# EAGLE schematic keycopy (EAGLE 6.3)
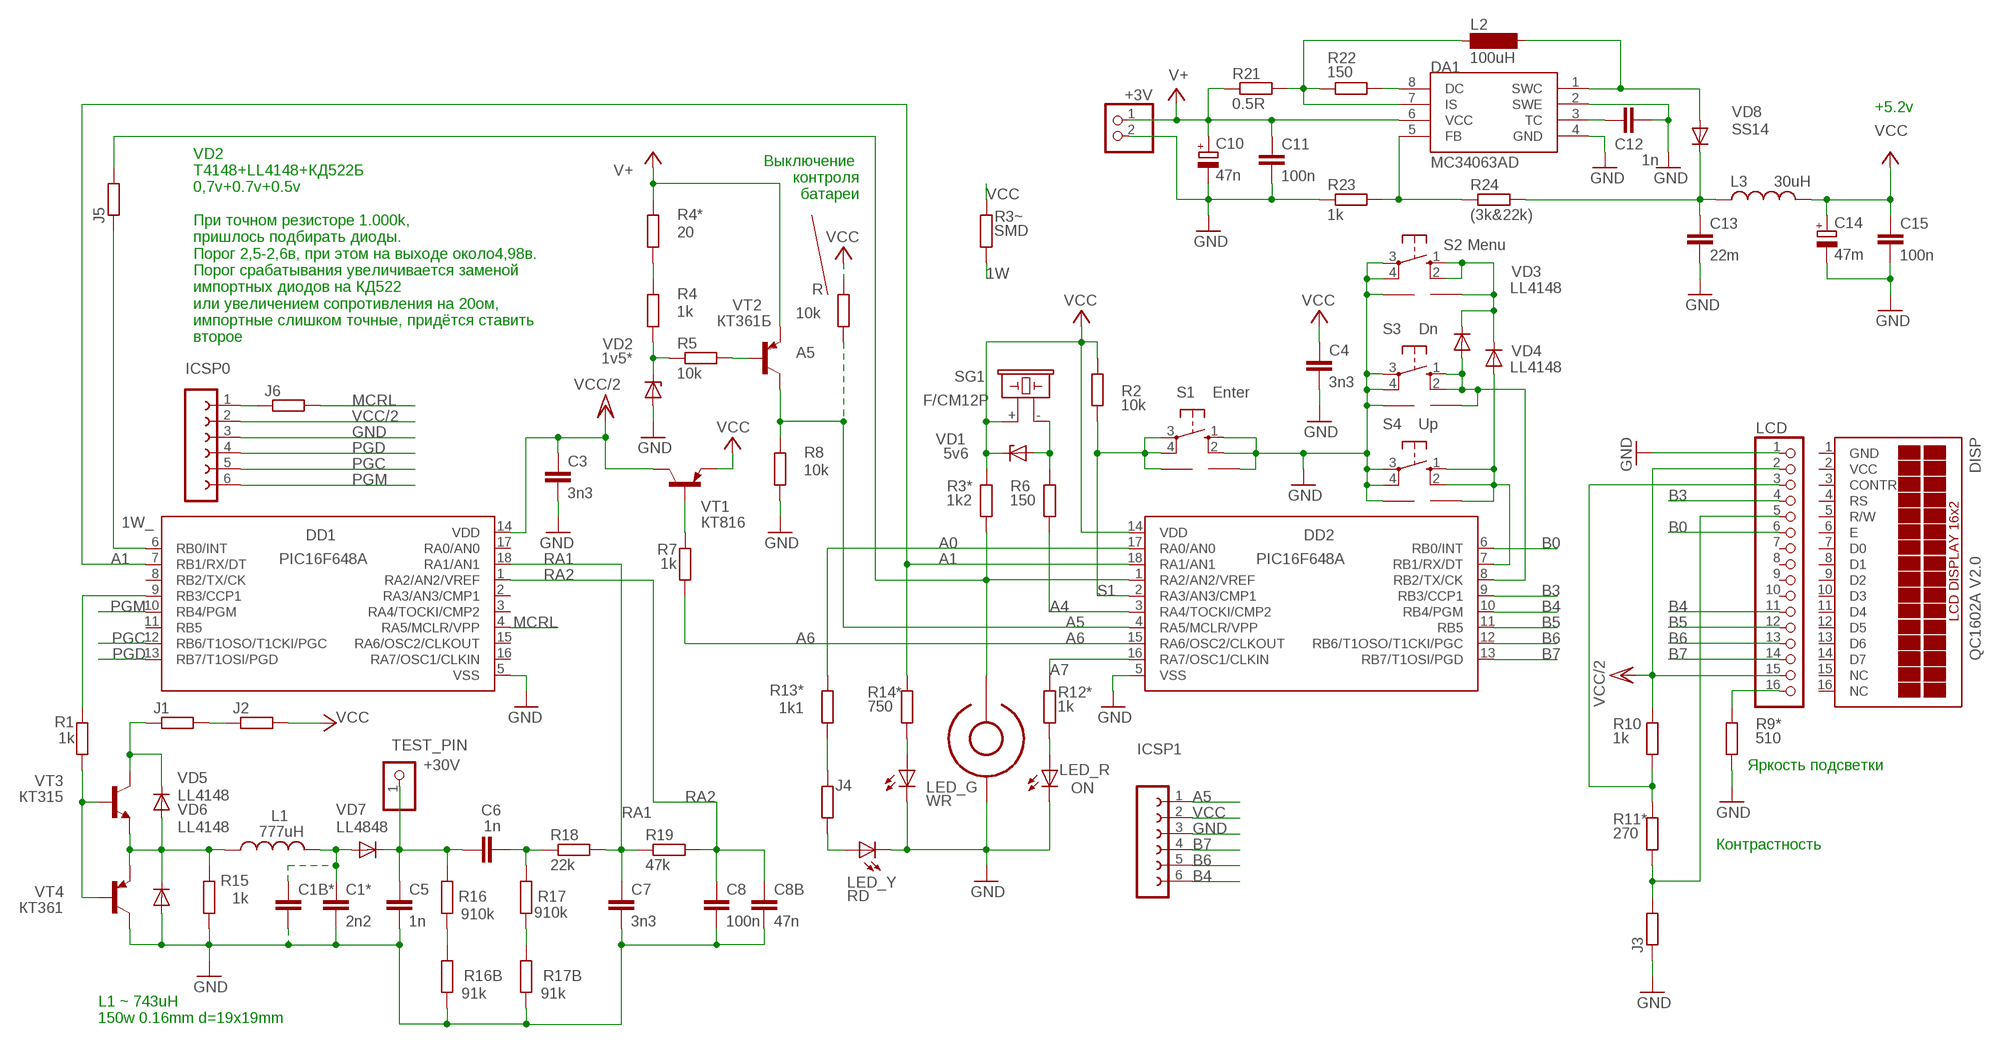
[diagram p0: schematic, sheet 1]

## Parts
+3V  PINHD-1X2  [1X02]
C1*  2n2  C-EU025-030X050  [C025-030X050]
C1B*  C-EU025-030X050  [C025-030X050]
C3  3n3  CAPPTH3  [CAP-PTH-LARGE]
C4  3n3  CAPPTH3  [CAP-PTH-LARGE]
C5  1n  C-EU025-030X050  [C025-030X050]
C6  1n  C-EU025-030X050  [C025-030X050]
C7  3n3  C-EU025-030X050  [C025-030X050]
C8  100n  C-EU025-030X050  [C025-030X050]
C8B  47n  C-EU025-030X050  [C025-030X050]
C10  47n  CPOL-EUE2.5-6  [E2,5-6]
C11  100n  C-EUC0805K  [C0805K]
C12  1n  C-EUC0805K  [C0805K]
C13  22m  C-EUC1210  [C1210]
C14  47m  CPOL-EUE2.5-6  [E2,5-6]
C15  100n  C-EUC0805K  [C0805K]
DA1  MC34063AD  [SOIC8]
DD1  PIC16F648A  PIC16F628SO  [SO-18W]
DD2  PIC16F648A  PIC16F628SO  [SO-18W]
DISP  QC1602A V2.0  TUXGR_16X2_R21  [TUXGR_16X2_1]
ICSP0  FE06-1  [FE06]
ICSP1  FE06-1  [FE06]
J1  R-EU_R1206W  [R1206W]
J2  R-EU_R1206W  [R1206W]
J3  R-EU_R1206W  [R1206W]
J4  R-EU_R1206W  [R1206W]
J5  R-EU_R1206W  [R1206W]
J6  R-EU_R0805W  [R0805W]
KEY  DS1990  [DS1990]
L1  777uH  L-US0207/2V  [0207/2V]
L2  100uH  SD12K100  [SD12K100]
L3  30uH  L-US0207/12  [0207/12]
LCD  PINHD-1X16  [1X16]
LED_G  WR  LED3MM  [LED3MM]
LED_R  ON  LED3MM  [LED3MM]
LED_Y  RD  LED3MM  [LED3MM]
R  10k  R-EU_R0805  [R0805]
R1  1k  R-EU_R1206W  [R1206W]
R2  10k  R-EU_R1206W  [R1206W]
R3*  1k2  R-EU_0204/7  [0204/7]
R3~  SMD  R-EU_M0805  [M0805]
R4  1k  R-EU_R1206W  [R1206W]
R4*  20  R-EU_R0805  [R0805]
R5  10k  R-EU_R0805  [R0805]
R6  150  R-EU_R0805  [R0805]
R7  1k  R-EU_R0805  [R0805]
R8  10k  R-EU_R1206W  [R1206W]
R9*  510  R-EU_R0805  [R0805]
R10  1k  R-EU_R0805  [R0805]
R11*  270  R-EU_0207/10  [0207/10]
R12*  1k  R-EU_R0805  [R0805]
R13*  1k1  R-EU_0207/10  [0207/10]
R14*  750  R-EU_0207/10  [0207/10]
R15  1k  R-EU_R0805  [R0805]
R16  910k  R-EU_R0805  [R0805]
R16B  91k  R-EU_R0805  [R0805]
R17  910k  R-EU_R0805  [R0805]
R17B  91k  R-EU_R0805  [R0805]
R18  22k  R-EU_R0805  [R0805]
R19  47k  R-EU_R0805  [R0805]
R21  0.5R  R-EU_R0805  [R0805]
R22  150  R-EU_R0805  [R0805]
R23  1k  R-EU_R0805  [R0805]
R24  (3k&22k)  R-EU_R1206W  [R1206W]
S1  Enter  10-XX  [B3F-10XX]
S2  Menu  10-XX  [B3F-10XX]
S3  Dn  10-XX  [B3F-10XX]
S4  Up  10-XX  [B3F-10XX]
SG1  F/CM12P  [F/CM12P]
TEST_PIN  +30V  PINHD-1X1  [1X01]
U$1  PROGRAMMER_5.08  [PROGRAMMER_KEY]
U$6  PROGRAMMER_5.08  [PROGRAMMER_KEY]
U$7  PROGRAMMER_5.08  [PROGRAMMER_KEY]
U$8  PROGRAMMER_5.08  [PROGRAMMER_KEY]
VD1  5v6  ZENER-DIODESOD80C  [SOD80C]
VD2  1v5*  ZENER-DIODEZD-5  [ZDIO-5]
VD3  LL4148  DIODE-SOD80C  [SOD80C]
VD4  LL4148  DIODE-SOD80C  [SOD80C]
VD5  LL4148  DIODE-SOD80C  [SOD80C]
VD6  LL4148  DIODE-SOD80C  [SOD80C]
VD7  LL4848  DIODE-SOD80C  [SOD80C]
VD8  SS14  DIODE-SMB  [SMB]
VT1  КТ816  BD140  [TO126]
VT2  КТ361Б  2SC1815-PNP-TO92-BCE  [TO92-BCE]
VT3  КТ315  -NPN-TO92-ECB  [TO92-ECB]
VT4  КТ361  2SC1815-PNP-TO92-BCE  [TO92-BCE]

## Nets
1W: DD2.1(RA2/AN2/VREF) J5.2 KEY.P$1 R3*.1 R3~.1
1W_: DD1.6(RB0/INT) J5.1
A0: DD2.17(RA0/AN0) R13*.2
A1: DD1.7(RB1/RX/DT) DD2.18(RA1/AN1) R14*.2
A4: DD2.3(RA4/TOCKI/CMP2) R6.1
A5: DD2.4(RA5/MCLR/VPP) ICSP1.1 R8.2 R.1 VT2.C
A6: DD2.15(RA6/OSC2/CLKOUT) R7.1
A7: DD2.16(RA7/OSC1/CLKIN) R12*.2
B0: DD2.6(RB0/INT) LCD.6
B3: DD2.9(RB3/CCP1) LCD.4
B4: DD2.10(RB4/PGM) ICSP1.6 LCD.11
B5: DD2.11(RB5) LCD.12
B6: DD2.12(RB6/T1OSO/T1CKI/PGC) ICSP1.5 LCD.13
B7: DD2.13(RB7/T1OSI/PGD) ICSP1.4 LCD.14
GND: +3V.2 C1*.2 C1B*.2 C3.2 C4.2 C5.2 C7.2 C8.2 C8B.2 C10.- C11.2 C12.2 C13.2 C14.- C15.2 DA1.2(SWE) DA1.4(GND) DD1.5(VSS) DD2.5(VSS) ICSP0.3 ICSP1.3 J3.1 KEY.P$2 LCD.1 LED_G.K(C) LED_R.K(C) LED_Y.K(C) R8.1 R9*.1 R15.1 R16B.1 R17B.1 R23.1 S1.1(S) S1.2(S1) S2.3(P) S2.4(P1) S3.3(P) S3.4(P1) S4.3(P) S4.4(P1) U$1.P$2 U$6.P$1 U$7.P$1 U$8.P$1 VD2.A VD6.A VT4.C
LG: LED_G.A R14*.1
LR: LED_R.A R12*.1
LY: J4.1 LED_Y.A
MCRL: DD1.4(RA5/MCLR/VPP) J6.2
N$1: R1.1 VT3.B VT4.B
N$2: C1*.1 C1B*.1 L1.2 VD7.A
N$3: C13.1 L3.1 R24.2 VD8.C
N$4: DD1.9(RB3/CCP1) R1.2
N$6: C5.1 C6.1 R16.2 TEST_PIN.1 VD7.C
N$7: R7.2 VT1.3(B)
N$8: R6.2 SG1.- VD1.A
N$9: LCD.16 R9*.2
N$10: J1.1 VD5.C VT3.C
N$11: R16.1 R16B.2
N$12: LCD.3 R10.1 R11*.2
N$13: DD2.7(RB1/RX/DT) S4.1(S) S4.2(S1) U$6.P$2 VD4.A
N$14: S2.1(S) S2.2(S1) U$8.P$2 VD3.C VD4.C
N$15: DD2.8(RB2/TX/CK) S3.1(S) S3.2(S1) U$7.P$2 VD3.A
N$16: C6.2 R17.2 R18.1
N$17: R4.1 R5.1 VD2.C
N$18: R5.2 VT2.B
N$19: ICSP0.1 J6.1
N$20: J4.2 R13*.1
N$21: L1.1 R15.2 VD5.A VD6.C VT3.E VT4.E
N$22: J1.2 J2.1
N$23: R17.1 R17B.2
N$24: J3.2 LCD.5 R11*.1
N$26: C12.1 DA1.3(TC)
N$28: DA1.1(SWC) L2.2 VD8.A
N$29: DA1.7(IS) L2.1 R21.2 R22.1
N$30: DA1.8(DC) R22.2
N$31: DA1.5(FB) R23.2 R24.1
N$38: R4*.1 R4.2
PGC: DD1.12(RB6/T1OSO/T1CKI/PGC) ICSP0.5
PGD: DD1.13(RB7/T1OSI/PGD) ICSP0.4
PGM: DD1.10(RB4/PGM) ICSP0.6
RA1: C7.1 DD1.18(RA1/AN1) R18.2 R19.1
RA2: C8.1 C8B.1 DD1.1(RA2/AN2/VREF) R19.2
S1: DD2.2(RA3/AN3/CMP1) R2.1 S1.3(P) S1.4(P1) U$1.P$1
V+: +3V.1 C10.+ C11.1 DA1.6(VCC) R4*.2 R21.1 VT2.E
VCC: C4.1 C14.+ C15.1 DD2.14(VDD) ICSP1.2 J2.2 L3.2 R2.2 R3*.2 R3~.2 R.2 SG1.+ VD1.C VT1.1(E)
VCC/2: C3.1 DD1.14(VDD) ICSP0.2 LCD.2 LCD.15 R10.2 VT1.2(C)
Unconnected: DD1.2(RA3/AN3/CMP1) DD1.3(RA4/TOCKI/CMP2) DD1.8(RB2/TX/CK) DD1.11(RB5) DD1.15(RA6/OSC2/CLKOUT) DD1.16(RA7/OSC1/CLKIN) DD1.17(RA0/AN0) DISP.3(CONTR) DISP.4(RS) DISP.5(R/W) DISP.6(E) DISP.7(D0) DISP.8(D1) DISP.9(D2) DISP.10(D3) DISP.11(D4) DISP.12(D5) DISP.13(D6) DISP.14(D7) DISP.15(NC) DISP.16(NC) LCD.7 LCD.8 LCD.9 LCD.10

## Notes on the sheet
- +5.2v
- Выключение 
  контроля
  батареи
- VD2
  T4148+LL4148+КД522Б 
  0,7v+0.7v+0.5v
  
  При точном резисторе 1.000k, 
  пришлось подбирать диоды.
  Порог 2,5-2,6в, при этом на выходе около4,98в.
  Порог срабатывания увеличивается заменой
  импортных диодов на КД522 
  или увеличением сопротивления на 20ом, 
  импортные слишком точные, придётся ставить
  второе
- Яркость подсветки
- Контрастность
- L1 ~ 743uH
  150w 0.16mm d=19x19mm

## Power pins joined to a net without a drawn wire
GND: DISP.1(GND)
VCC: DISP.2(VCC)

## Library data of the parts
+3V = keycopy:PINHD-1X2: PIN HEADER
C1* C1B* C5-C8 C8B = keycopy:C-EU: CAPACITOR, European symbol
C3 C4 = keycopy:CAP: Capacitor Standard 0603 ceramic capacitor, and 0.1" leaded capacitor.
C10 C14 = keycopy:CPOL-EU: POLARIZED CAPACITOR, European symbol
C11 C12 C15 = resistor:C-EU: CAPACITOR, European symbol
C13 = rcl:C-EU: CAPACITOR, European symbol
DA1 = mc34063:MC34063
DD1 DD2 = microchip:PIC16F62*: FLASH-Based 8-Bit CMOS Microcontroller Source: http://ww1.microchip.com/downloads/en/DeviceDoc/40300C.pdf; MF: MICROCHIP; MPN: PIC16F628-20I/SO; OC_FARNELL: 9760415; OC_NEWARK: 23C4986
DISP = keycopy:TUXGR_16X2_R2: Tuxgraphics LCD display 16x2 characters reflective, without background light Source: tuxgr_12x2_r2.pdf
ICSP0 ICSP1 = con-lsta:FE06-1: FEMALE HEADER; OC_FARNELL: unknown; OC_NEWARK: unknown
J1-J6 R1 R3* R3~ R7 R9* R11* R13* R14* = keycopy:R-EU_: RESISTOR, European symbol
KEY = keysens:DS1990
L1 = keycopy:L-US: INDUCTOR, American symbol
L2 = inductor-neosid:SD12: INDUCTOR nominal inductance; OC_FARNELL: unknown; OC_NEWARK: unknown
L3 = rcl:L-US: INDUCTOR, American symbol
LCD = pinhead:PINHD-1X16: PIN HEADER
LED_G LED_Y = keycopy2:LED: LED OSRAM: - CHIPLED LG R971, LG N971, LY N971, LG Q971, LY Q971, LO R971, LY R971 LH N974, LH R974 LS Q976, LO Q976, LY Q976 LO Q996 - Hyper CHIPLED LW Q18S LB Q993, LB Q99A, LB R99A - SideLED LS A670, LO A670, LY A670, LG A670, LP A670 LB A673, LV A673, LT A673, LW A673 LH A674 LY A675 LS A676, LA A676, LO A676, LY A676, LW A676 LS A679, LY A679, LG A679 - Hyper Micro SIDELED® LS Y876, LA Y876, LO Y876, LY Y876 LT Y87S - SmartLED LW L88C, LW L88S LB L89C, LB L89S, LG L890 LS L89K, LO L89K, LY L89K LS L896, LA L896, LO L896, LY L896 - TOPLED LS T670, LO T670, LY T670, LG T670, LP T670 LSG T670, LSP T670, LSY T670, LOP T670, LYG T670 LG T671, LOG T671, LSG T671 LB T673, LV T673, LT T673, LW T673 LH T674 LS T676, LA T676, LO T676, LY T676, LB T676, LH T676, LSB T676, LW T676 LB T67C, LV T67C, LT T67C, LS T67K, LO T67K, LY T67K, LW E67C LS E67B, LA E67B, LO E67B, LY E67B, LB E67C, LV E67C, LT E67C LW T67C LS T679, LY T679, LG T679 LS T770, LO T770, LY T770, LG T770, LP T770 LB T773, LV T773, LT T773, LW T773 LH T774 LS E675, LA E675, LY E675, LS T675 LS T776, LA T776, LO T776, LY T776, LB T776 LHGB T686 LT T68C, LB T68C - Hyper Mini TOPLED® LB M676 - Mini TOPLED Santana® LG M470 LS M47K, LO M47K, LY M47K Source: http://www.osram.convergy.de LUXEON: - LUMILED® LXK2-PW12-R00, LXK2-PW12-S00, LXK2-PW14-U00, LXK2-PW14-V00 LXK2-PM12-R00, LXK2-PM12-S00, LXK2-PM14-U00 LXK2-PE12-Q00, LXK2-PE12-R00, LXK2-PE12-S00, LXK2-PE14-T00, LXK2-PE14-U00 LXK2-PB12-K00, LXK2-PB12-L00, LXK2-PB12-M00, LXK2-PB14-N00, LXK2-PB14-P00, LXK2-PB14-Q00 LXK2-PR12-L00, LXK2-PR12-M00, LXK2-PR14-Q00, LXK2-PR14-R00 LXK2-PD12-Q00, LXK2-PD12-R00, LXK2-PD12-S00 LXK2-PH12-R00, LXK2-PH12-S00 LXK2-PL12-P00, LXK2-PL12-Q00, LXK2-PL12-R00 Source: www.luxeon.com KINGBRIGHT: KA-3528ASYC Source: www.kingbright.com
LED_R = keycopy3:LED: LED OSRAM: - CHIPLED LG R971, LG N971, LY N971, LG Q971, LY Q971, LO R971, LY R971 LH N974, LH R974 LS Q976, LO Q976, LY Q976 LO Q996 - Hyper CHIPLED LW Q18S LB Q993, LB Q99A, LB R99A - SideLED LS A670, LO A670, LY A670, LG A670, LP A670 LB A673, LV A673, LT A673, LW A673 LH A674 LY A675 LS A676, LA A676, LO A676, LY A676, LW A676 LS A679, LY A679, LG A679 - Hyper Micro SIDELED® LS Y876, LA Y876, LO Y876, LY Y876 LT Y87S - SmartLED LW L88C, LW L88S LB L89C, LB L89S, LG L890 LS L89K, LO L89K, LY L89K LS L896, LA L896, LO L896, LY L896 - TOPLED LS T670, LO T670, LY T670, LG T670, LP T670 LSG T670, LSP T670, LSY T670, LOP T670, LYG T670 LG T671, LOG T671, LSG T671 LB T673, LV T673, LT T673, LW T673 LH T674 LS T676, LA T676, LO T676, LY T676, LB T676, LH T676, LSB T676, LW T676 LB T67C, LV T67C, LT T67C, LS T67K, LO T67K, LY T67K, LW E67C LS E67B, LA E67B, LO E67B, LY E67B, LB E67C, LV E67C, LT E67C LW T67C LS T679, LY T679, LG T679 LS T770, LO T770, LY T770, LG T770, LP T770 LB T773, LV T773, LT T773, LW T773 LH T774 LS E675, LA E675, LY E675, LS T675 LS T776, LA T776, LO T776, LY T776, LB T776 LHGB T686 LT T68C, LB T68C - Hyper Mini TOPLED® LB M676 - Mini TOPLED Santana® LG M470 LS M47K, LO M47K, LY M47K Source: http://www.osram.convergy.de LUXEON: - LUMILED® LXK2-PW12-R00, LXK2-PW12-S00, LXK2-PW14-U00, LXK2-PW14-V00 LXK2-PM12-R00, LXK2-PM12-S00, LXK2-PM14-U00 LXK2-PE12-Q00, LXK2-PE12-R00, LXK2-PE12-S00, LXK2-PE14-T00, LXK2-PE14-U00 LXK2-PB12-K00, LXK2-PB12-L00, LXK2-PB12-M00, LXK2-PB14-N00, LXK2-PB14-P00, LXK2-PB14-Q00 LXK2-PR12-L00, LXK2-PR12-M00, LXK2-PR14-Q00, LXK2-PR14-R00 LXK2-PD12-Q00, LXK2-PD12-R00, LXK2-PD12-S00 LXK2-PH12-R00, LXK2-PH12-S00 LXK2-PL12-P00, LXK2-PL12-Q00, LXK2-PL12-R00 Source: www.luxeon.com KINGBRIGHT: KA-3528ASYC Source: www.kingbright.com
R R2 R4 R4* R5 R6 R8 R10 R12* R15 R16 R16B R17 R17B R18 R19 = rcl:R-EU_: RESISTOR, European symbol
R21-R24 = resistor:R-EU_: RESISTOR, European symbol
S1-S4 = switch-omron:10-XX: OMRON SWITCH; MPN: B3F-1000; OC_FARNELL: 176432; OC_NEWARK: 36M3542
SG1 = buzzer:F/CM12P: BUZZER Source: Buerklin; OC_FARNELL: unknown; OC_NEWARK: unknown
TEST_PIN = keycopy:PINHD-1X1: PIN HEADER
U$1 U$6-U$8 = HWProgUSB:PROGRAMMER_5.08
VD1 = diode:ZENER-DIODE: Z-Diode
VD2 = keycopy:ZENER-DIODE: Z-Diode
VD3-VD8 = diode:DIODE-: DIODE
VT1 = keycopy:BD140: PNP Transistor
VT2 VT4 = keycopy:*-PNP-: PNP Transistror
VT3 = keycopy:*-NPN-: NPN Transistror BF959 corrected 2008.03.06